# Altium schematic sheet SH7 - LOAD MONITORING 2.SchDoc: Load Monitoring 2
size B; CheckedBy: Lance Bantoto; DrawnBy: Cindy Li; Engineer: Cindy Li; Organization: UW Robotics; Address1: 200 University Avenue; Address2: Waterloo; Address3: Ontario; Address4: Canada N2L 3G6; DocumentNumber: 7; Revision: 2; SheetNumber: 7; SheetTotal: 10
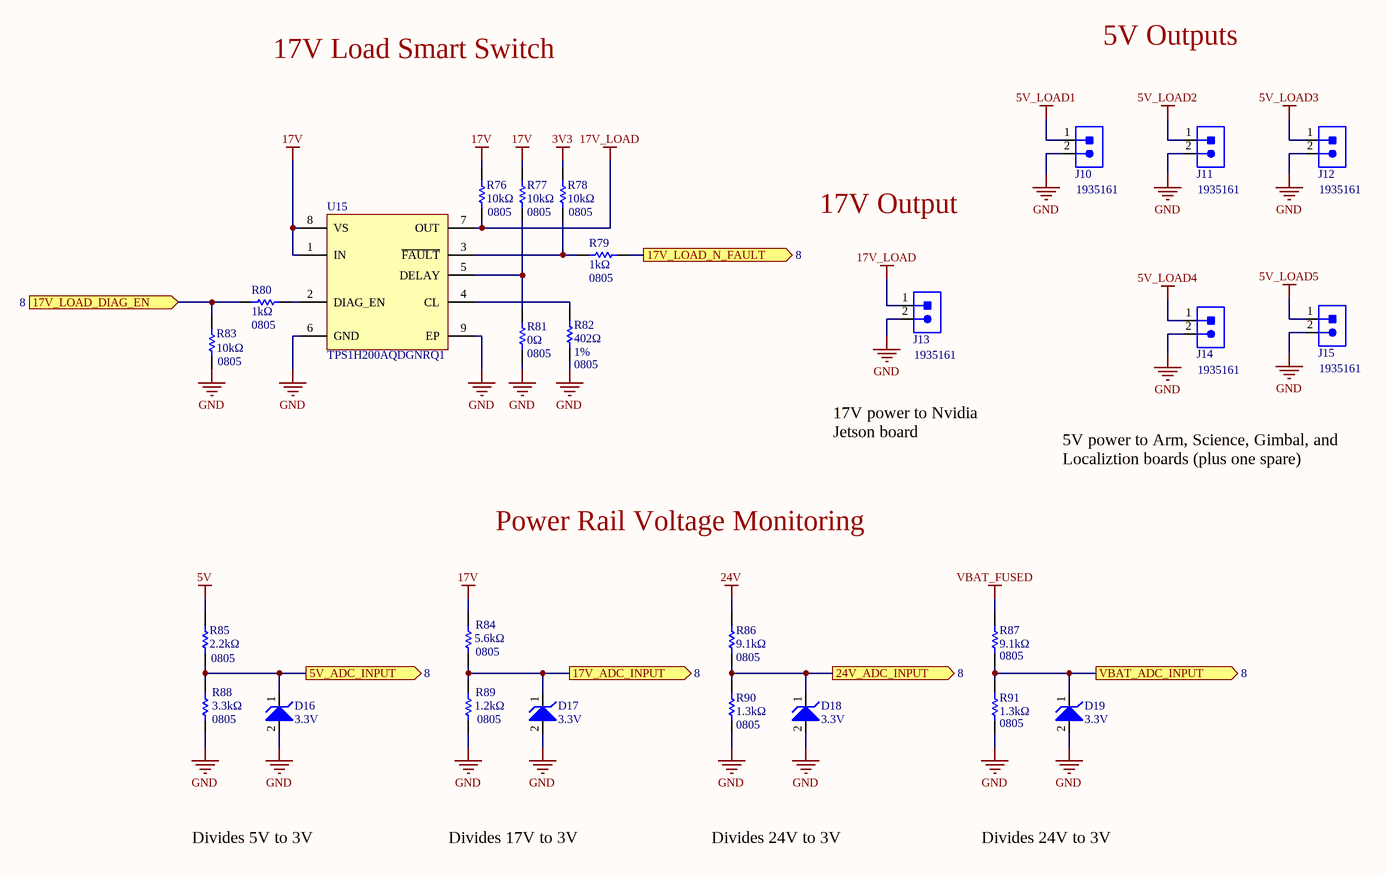
[diagram p0: SH7 - LOAD MONITORING 2.SchDoc]

## Parts
D16  Reverse Standoff Voltage: 3.3V  [SOD523]  (hidden comment: TVS_DIODE_UNIDIR_3.3V)
D17  Reverse Standoff Voltage: 3.3V  [SOD523]  (hidden comment: TVS_DIODE_UNIDIR_3.3V)
D18  Reverse Standoff Voltage: 3.3V  [SOD523]  (hidden comment: TVS_DIODE_UNIDIR_3.3V)
D19  Reverse Standoff Voltage: 3.3V  [SOD523]  (hidden comment: TVS_DIODE_UNIDIR_3.3V)
J10  CON_2M_TERM  [1935161]  (value not drawn)
J11  CON_2M_TERM  [1935161]  (value not drawn)
J12  CON_2M_TERM  [1935161]  (value not drawn)
J13  CON_2M_TERM  [1935161]  (value not drawn)
J14  CON_2M_TERM  [1935161]  (value not drawn)
J15  CON_2M_TERM  [1935161]  (value not drawn)
R76  value 10kΩ  Package/Footprint: 0805  [RESC0805]  (hidden comment: RES_10kΩ_0805_5%)
R77  value 10kΩ  Package/Footprint: 0805  [RESC0805]  (hidden comment: RES_10kΩ_0805_5%)
R78  value 10kΩ  Package/Footprint: 0805  [RESC0805]  (hidden comment: RES_10kΩ_0805_5%)
R79  Resistance: 1kΩ  Package/Footprint: 0805  [RESC0805]  (hidden comment: RES_1kΩ_0805_1%)
R80  Resistance: 1kΩ  Package/Footprint: 0805  [RESC0805]  (hidden comment: RES_1kΩ_0805_1%)
R81  value 0Ω  Package/Footprint: 0805  [RESC0805]  (hidden comment: RES_0Ω_0805)
R82  value 402Ω  Tolerance: 1%  Package/Footprint: 0805  [RESC0805]  (hidden comment: RES_402Ω_0805_1%)
R83  value 10kΩ  Package/Footprint: 0805  [RESC0805]  (hidden comment: RES_10kΩ_0805_5%)
R84  value 5.6kΩ  Package: 0805  [RESC0805]  (hidden comment: RES_5.6kΩ_0805)
R85  value 2.2kΩ  Package: 0805  [RESC0805]  (hidden comment: RES_2.2kΩ_0805)
R86  value 9.1kΩ  Package: 0805  [RESC0805]  (hidden comment: RES_9.1kΩ_0805)
R87  value 9.1kΩ  Package: 0805  [RESC0805]  (hidden comment: RES_9.1kΩ_0805)
R88  Resistance: 3.3kΩ  Package/Footprint: 0805  [RESC0805]  (hidden comment: RES_3.3kΩ_0805_1%)
R89  value 1.2kΩ  Package: 0805  [RESC0805]  (hidden comment: RES_1.2kΩ_0805)
R90  value 1.3kΩ  Package: 0805  [RESC0805]  (hidden comment: RES_1.3kΩ_0805)
R91  value 1.3kΩ  Package: 0805  [RESC0805]  (hidden comment: RES_1.3kΩ_0805)
U15  Manufacturer Part Number 1: TPS1H200AQDGNRQ1  [DGN0008G]  (hidden comment: TPS1H200A-Q1)

## Ports
5V_ADC_INPUT (out, see 8), 17V_ADC_INPUT (out, see 8), 17V_LOAD_DIAG_EN (in, see 8), 17V_LOAD_N_FAULT (out, see 8), 24V_ADC_INPUT (out, see 8), VBAT_ADC_INPUT (out, see 8)

## Nets
3V3: R78.2
5V: R85.2
5V_LOAD1: J10.1
5V_LOAD2: J11.1
5V_LOAD3: J12.1
5V_LOAD4: J14.1
5V_LOAD5: J15.1
17V: R76.2 R77.2 R84.2 U15.1(IN) U15.8(VS)
17V_LOAD: J13.1 R76.1 U15.7(OUT)
24V: R86.2
GND: D16.2 D17.2 D18.2 D19.2 J10.2 J11.2 J12.2 J13.2 J14.2 J15.2 R81.1 R82.1 R83.1 R88.1 R89.1 R90.1 R91.1 U15.6(GND) U15.9(EP)
VBAT_FUSED: R87.2
5V_ADC_INPUT: D16.1 R85.1 R88.2 ; port 5V_ADC_INPUT
17V_ADC_INPUT: D17.1 R84.1 R89.2 ; port 17V_ADC_INPUT
17V_LOAD_DIAG_EN: R80.1 R83.2 ; port 17V_LOAD_DIAG_EN
17V_LOAD_N_FAULT: R79.2 ; port 17V_LOAD_N_FAULT
24V_ADC_INPUT: D18.1 R86.1 R90.2 ; port 24V_ADC_INPUT
VBAT_ADC_INPUT: D19.1 R87.1 R91.2 ; port VBAT_ADC_INPUT
NetR77_1: R77.1 R81.2 U15.5(DELAY)
NetR78_1: R78.1 R79.1 U15.3(~{FAULT})
NetR80_2: R80.2 U15.2(DIAG_EN)
NetR82_2: R82.2 U15.4(CL)

## Notes on the sheet
- 5V Outputs
- 17V Load Smart Switch
- 17V Output
- 17V power to Nvidia Jetson board
- 5V power to Arm, Science, Gimbal, and Localiztion boards (plus one spare)
- Power Rail Voltage Monitoring
- Divides 5V to 3V
- Divides 17V to 3V
- Divides 24V to 3V
- Title:
- Project:
- Date:
- Rev:
- Reviewer:
- Engineer:
- Sheet:
- of

## Library data of the parts
D16-D19 = TVS_DIODE_UNIDIR_3.3V: TVS DIODE 3.3V 14.1V SOD523; Manufacturer 1: ON Semiconductor; Manufacturer Part Number 1: ESD5Z3.3T1G; Polarity: Unidirectional; Reverse Breakdown Voltage: 5V; Package/Footprint: SOD-523; Supplier 1: Digi-Key; Clamping Voltage: 14.1V; Supplier Part Number 1: ESD5Z3.3T1GOSCT-ND; LCSC Part #: C61148; Mounting Type: SMD
J10-J15 = CON_2M_TERM: TERM BLK 2POS SIDE ENTRY 5MM; Manufacturer 1: Phoenix Contact; Max Current Rating: 16A; Current: 18A; Voltage: 300V; Package/Footprint: SMD; Supplier 1: Digi-Key; Supplier Part Number 1: 277-1667-ND; Manufacturer Part Number 1: 1935161; Mounting Type: TH
R76-R78 R83 = RES_10kΩ_0805_5%: RES 10K OHM 5% 1/8W 0805; Manufacturer 1: Panasonic Electronic Components; Manufacturer Part Number 1: ERJ-6GEYJ103V; Supplier Part Number 1: P10KACT-ND; Supplier 1: Digi-Key; LCSC Part #: C17414; Mounting Type: SMD
R79 R80 = RES_1kΩ_0805_1%: RES 1K OHM 1% 1/8W 0805; Manufacturer 1: Yageo; Manufacturer Part Number 1: RC0805FR-071KL; Supplier Part Number 1: 311-1.00KCRCT-ND; Supplier 1: Digi-Key; Tolerance: 1%; LCSC Part #: C17513; Mounting Type: SMD
R81 = RES_0Ω_0805: RES 0 OHM JUMPER 1/8W 0805; Manufacturer 1: Panasonic Electronic Components; Manufacturer Part Number 1: ERJ-6GEY0R00V; Supplier Part Number 1: P0.0ACT-ND; Supplier 1: Digi-Key; LCSC Part #: C17477; Mounting Type: SMD
R82 = RES_402Ω_0805_1%: RES 402 OHM 1% 1/8W 0805; Manufacturer 1: Stackpole Electronics Inc; Manufacturer Part Number 1: RMCF0805FT402R; Supplier 1: Digi-Key; Supplier Part Number 1: RMCF0805FT402RCT-ND; LCSC Part #: C17681; Mounting Type: SMD
R84 = RES_5.6kΩ_0805_5%: RES SMD 5.6K OHM 5% 1/8W 0805; Manufacturer 1: Yageo; Manufacturer Part Number 1: RC0805JR-075K6L; Supplier Part Number 1: 311-5.6KARCT-ND; Supplier 1: Digi-Key; Tolerance: 5%
R85 = RES_2.2kΩ_0805_5%: RES 2.2K OHM 5% 1/8W 0805; Manufacturer 1: Vishay Dale; Manufacturer Part Number 1: CRCW08052K20JNEAC; Supplier Part Number 1: 541-4169-1-ND; Supplier 1: Digi-Key; Tolerance: 5%
R86 R87 = RES_9.1kΩ_0805_5%: RES SMD 9.1K OHM 5% 1/8W 0805; Manufacturer 1: Yageo; Manufacturer Part Number 1: RC0805JR-079K1L; Supplier Part Number 1: 311-9.1KARCT-ND; Supplier 1: Digi-Key; Tolerance: 5%
R88 = RES_3.3kΩ_0805_1%: RES 3.3K OHM 1% 1/8W 0805; Manufacturer 1: Vishay Dale; Manufacturer Part Number 1: CRCW06033K30FKEA; Supplier 1: Digi-Key; Supplier Part Number 1: 541-3.30KHCT-ND; Tolerance: 1%; LCSC Part #: C26010; Mounting Type: SMD
R89 = RES_1.2kΩ_0805_5%: RES SMD 1.2K OHM 5% 1/8W 0805; Manufacturer 1: Yageo; Manufacturer Part Number 1: RC0805JR-071K2L; Supplier 1: Digi-Key; Supplier Part Number 1: 311-1.2KARCT-ND; Tolerance: 5%
R90 R91 = RES_1.3kΩ_0805_5%: RES SMD 1.3K OHM 5% 1/8W 0805; Manufacturer 1: Yageo; Manufacturer Part Number 1: RC0805JR-071K3L; Supplier 1: Digi-Key; Supplier Part Number 1: 311-1.3KARCT-ND; Tolerance: 5%
U15 = TPS1H200A-Q1: IC PWR DRIVER N-CHAN 1:1 8MSOP; Manufacturer 1: Texas Instruments; Output Type: N-Channel; Supply Voltage: 4V - 40V; Output Current (Max): 2.5A; Rds On (Typ): 200mOhm; Package/Footprint: 8-TSSOP; Supplier 1: Digi-Key; Supplier Part Number 1: 296-50416-1-ND; Operating Temperature: 40°C - 125°C; Mounting Type: SMD